# Altium schematic sheet USB3.0.SchDoc
size D; DocumentNumber: 3; SheetNumber: 3
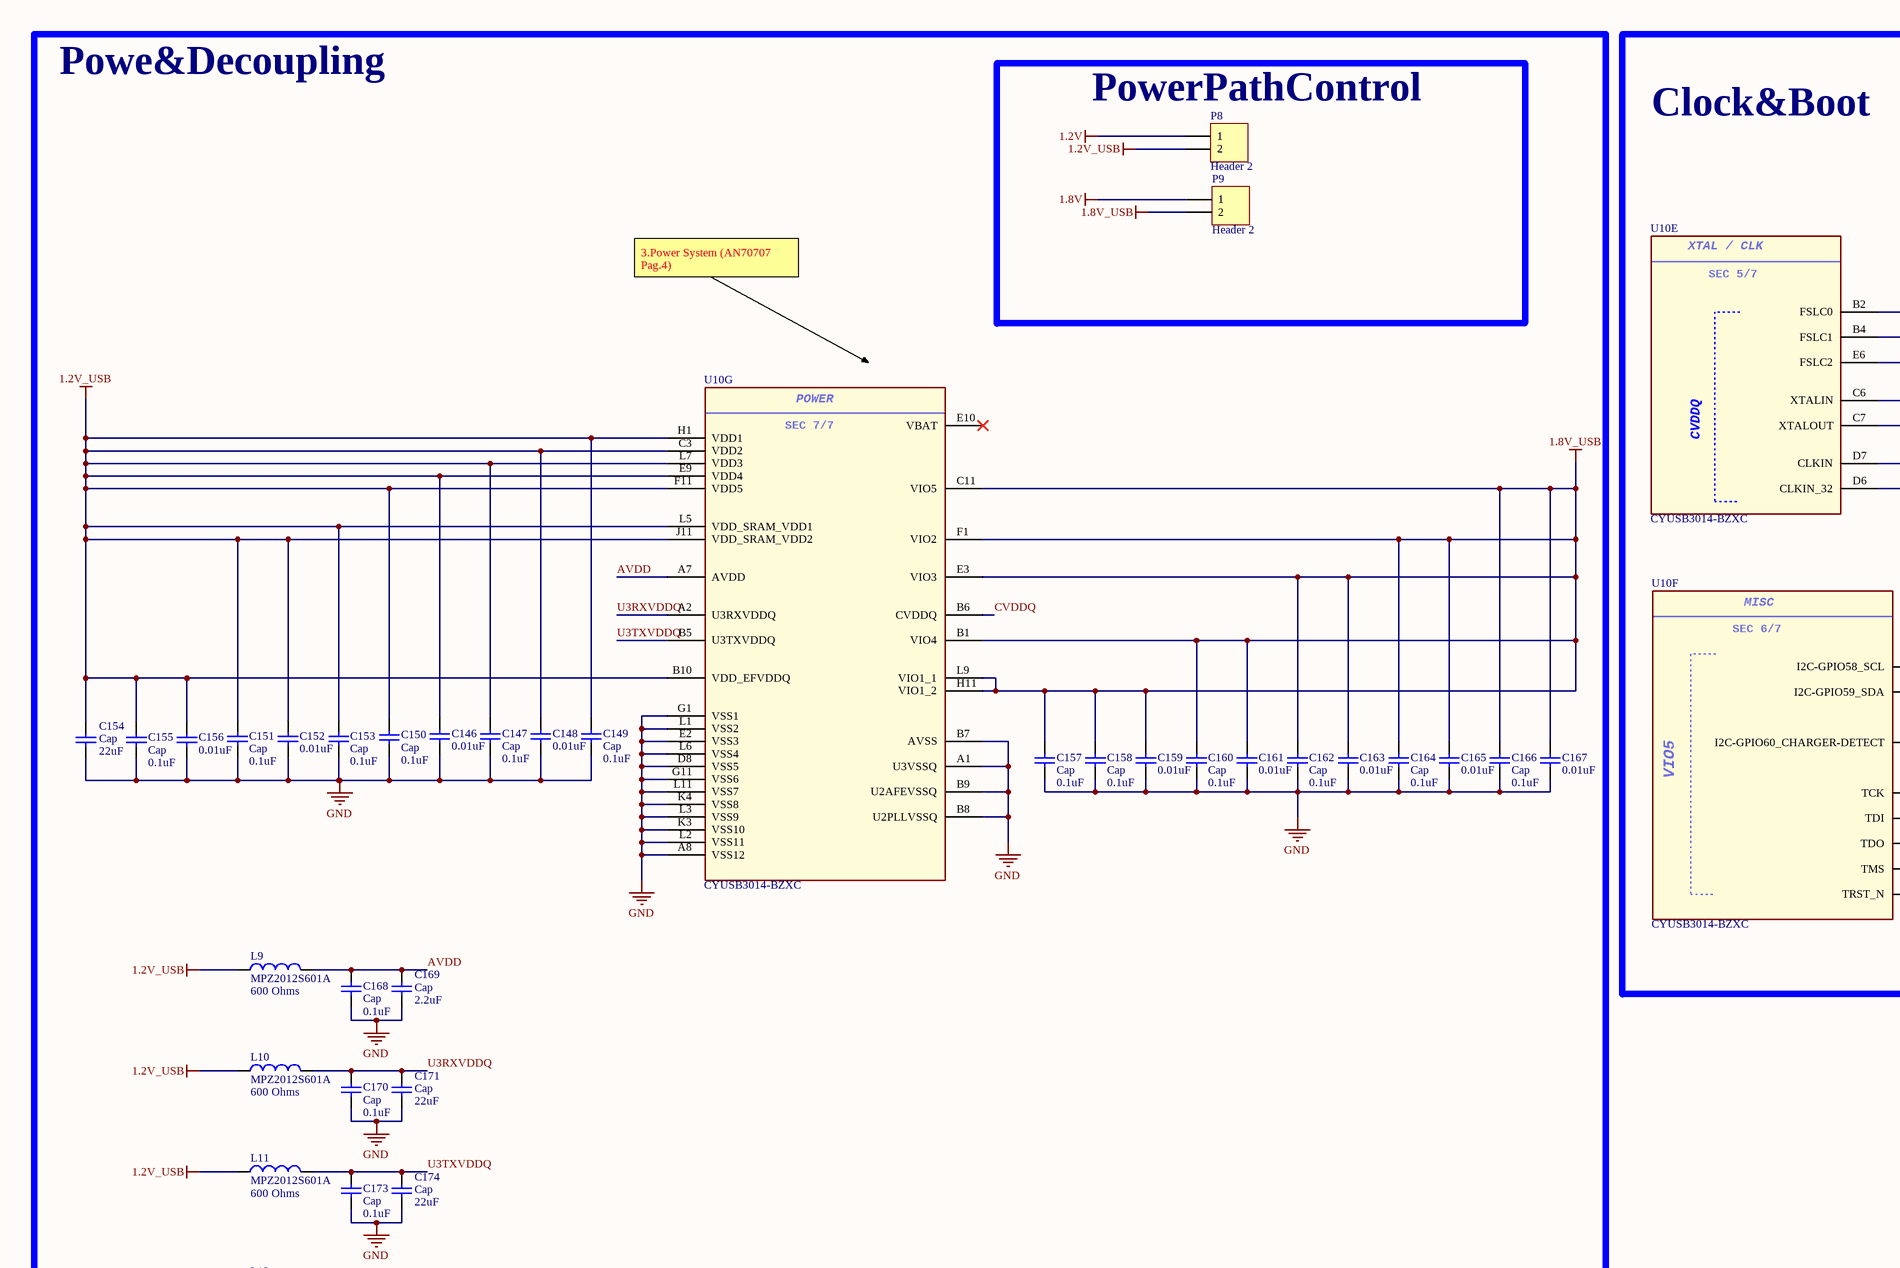
[diagram p0: USB3.0.SchDoc, top left]
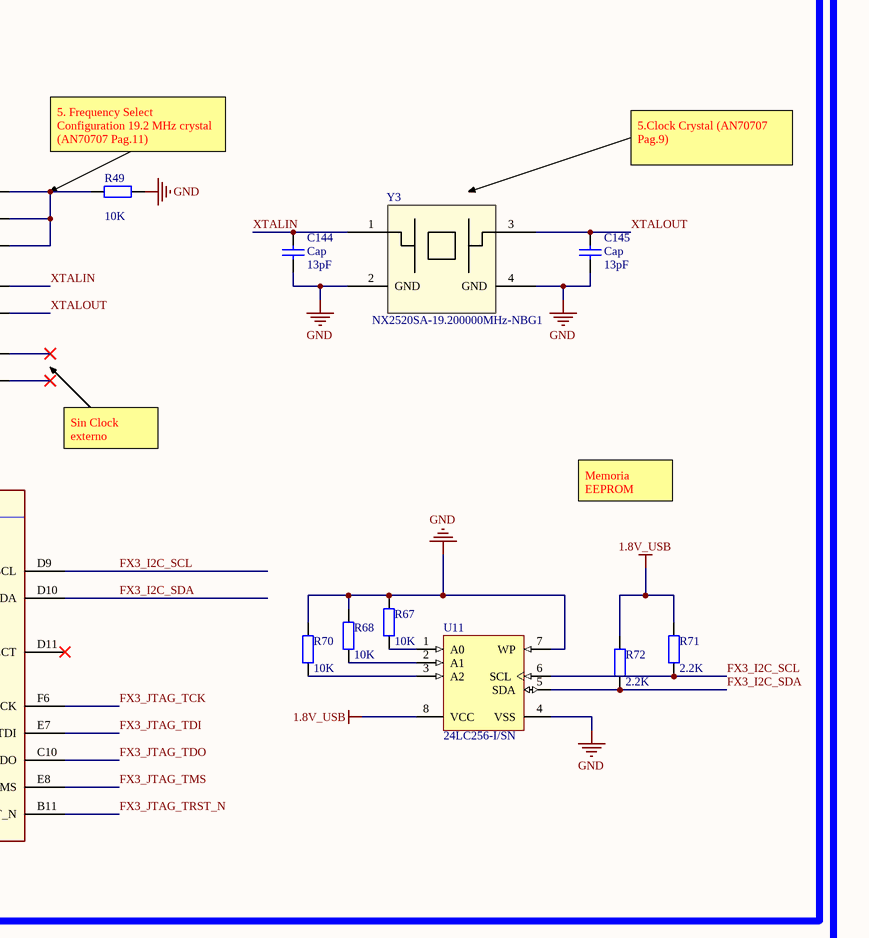
[diagram p1: USB3.0.SchDoc, top middle]
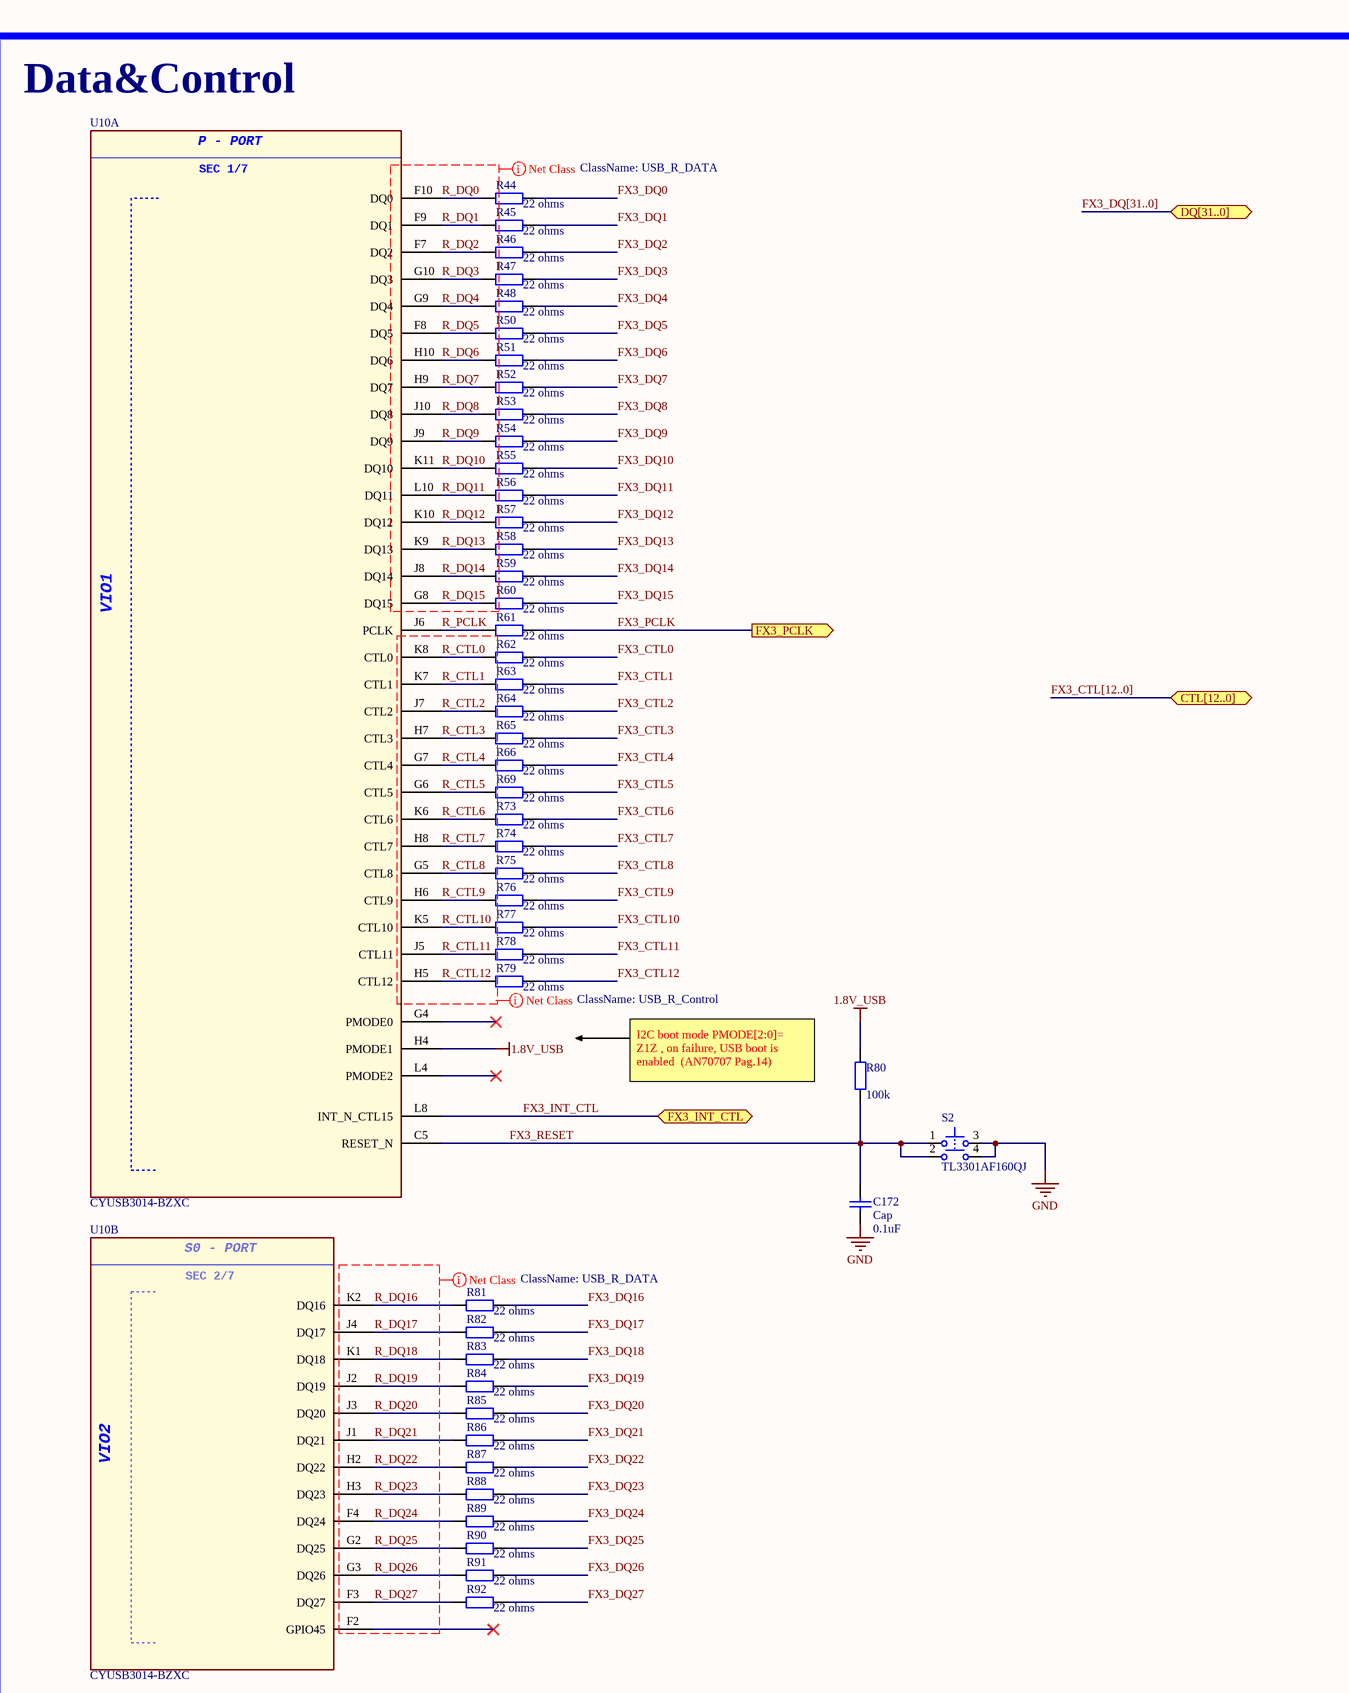
[diagram p2: USB3.0.SchDoc, top right]
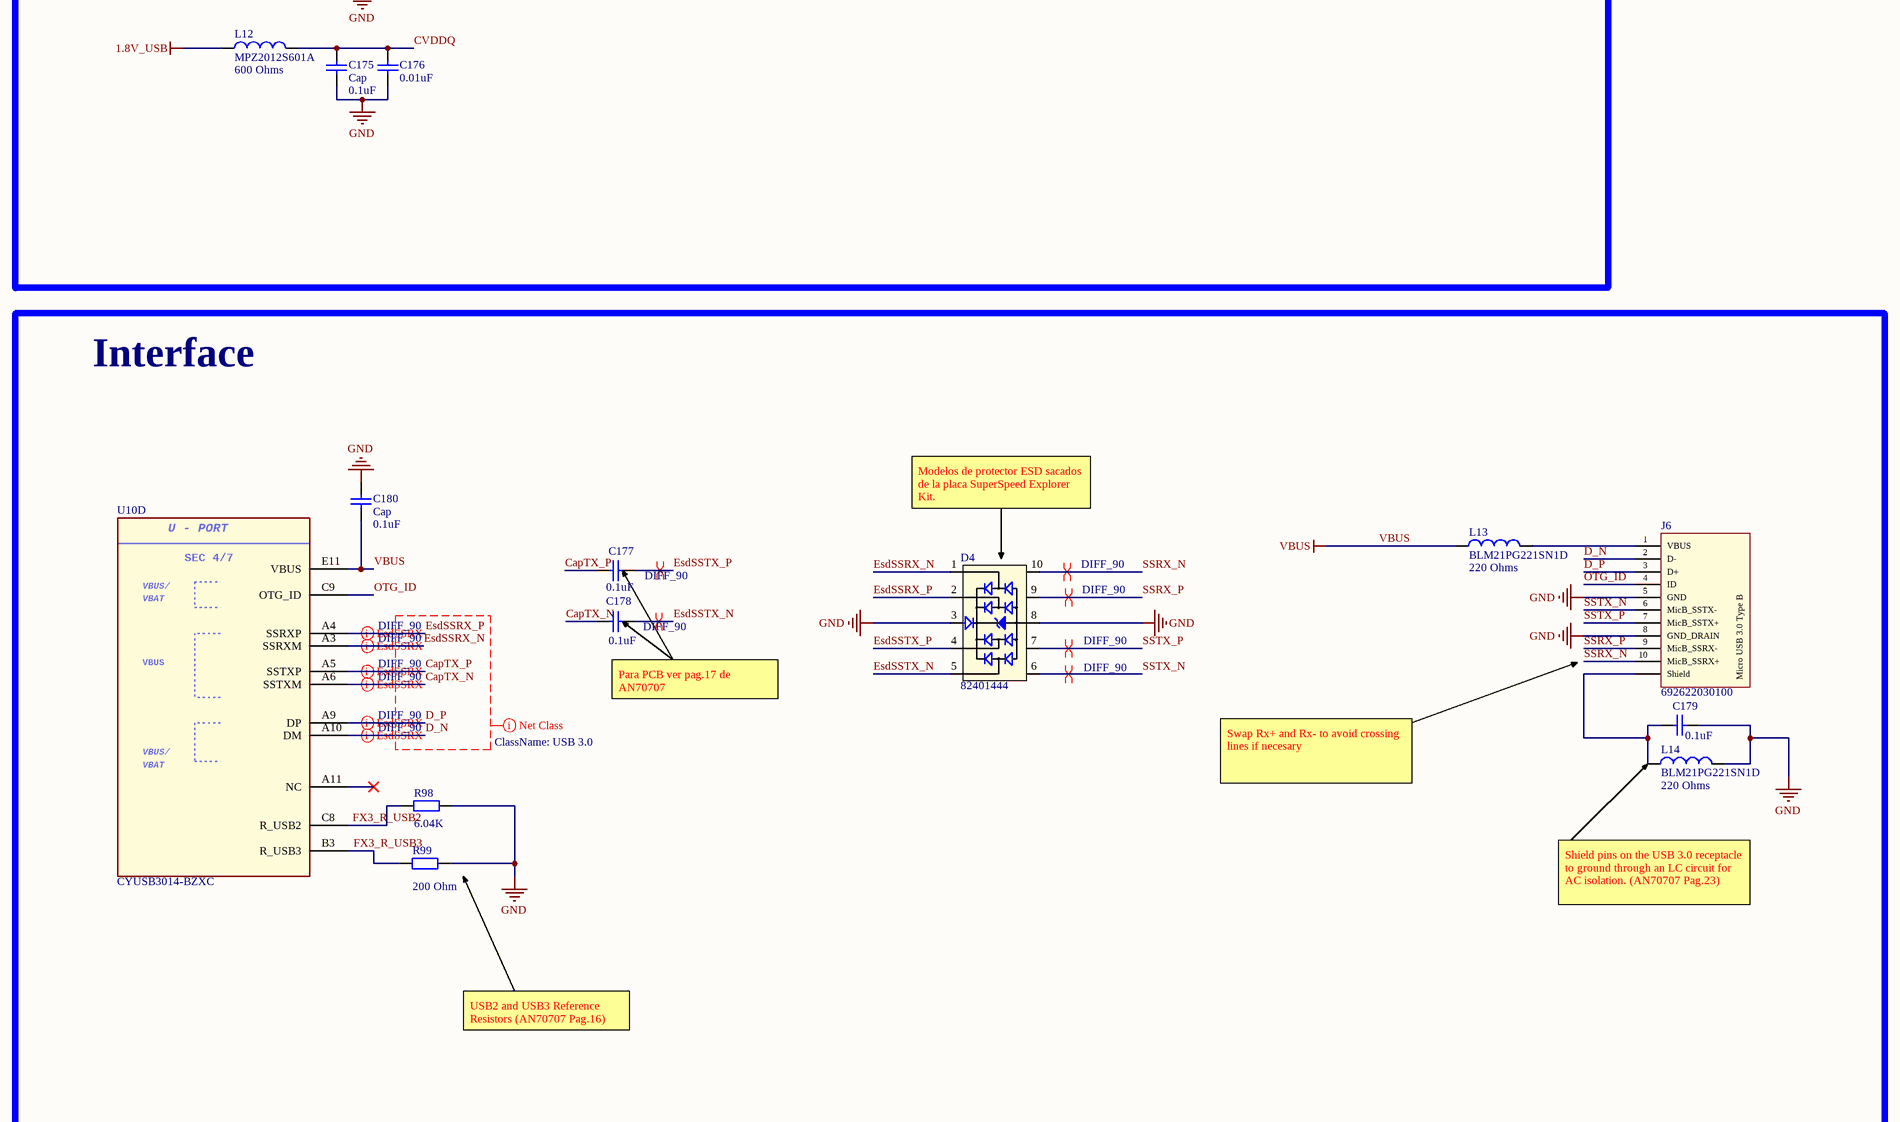
[diagram p3: USB3.0.SchDoc, bottom left]
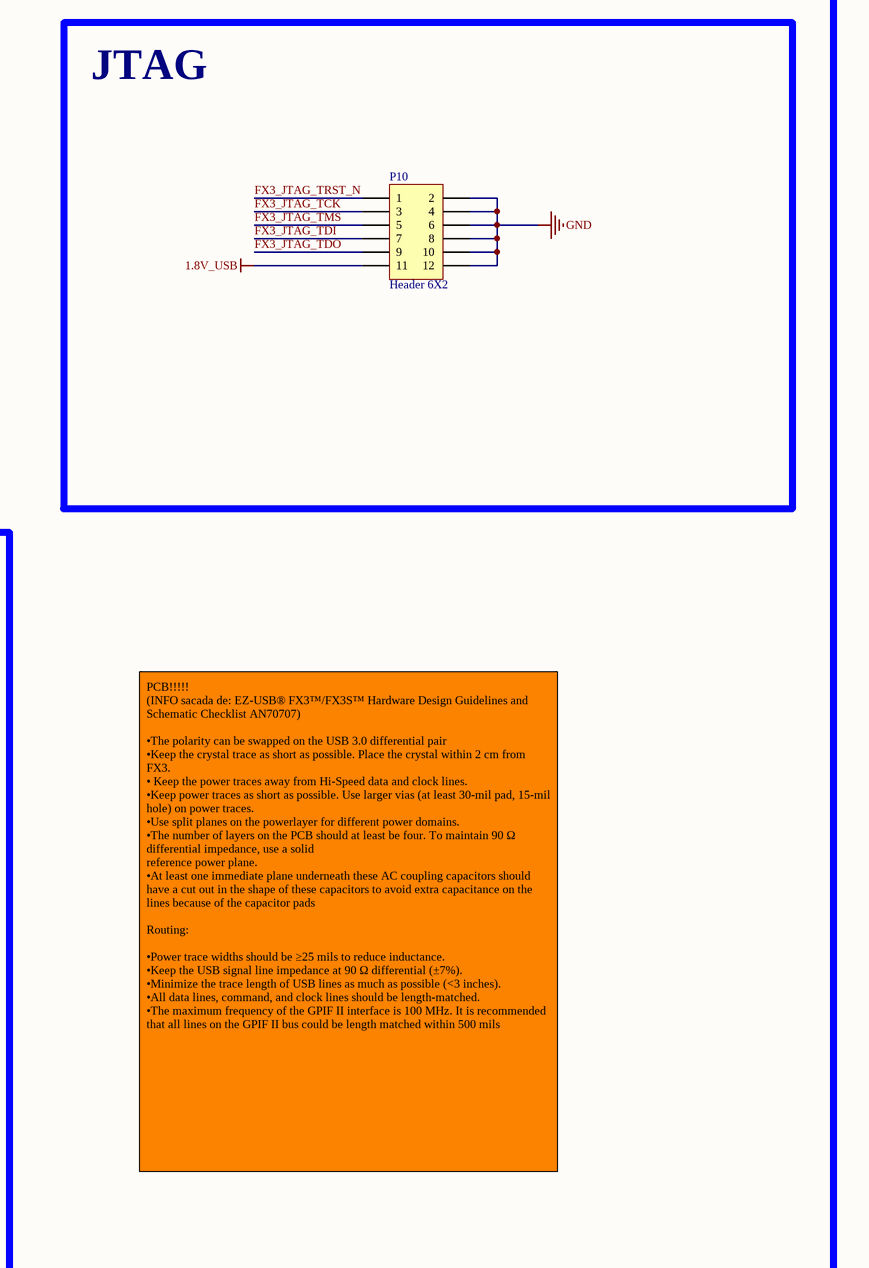
[diagram p4: USB3.0.SchDoc, bottom middle]
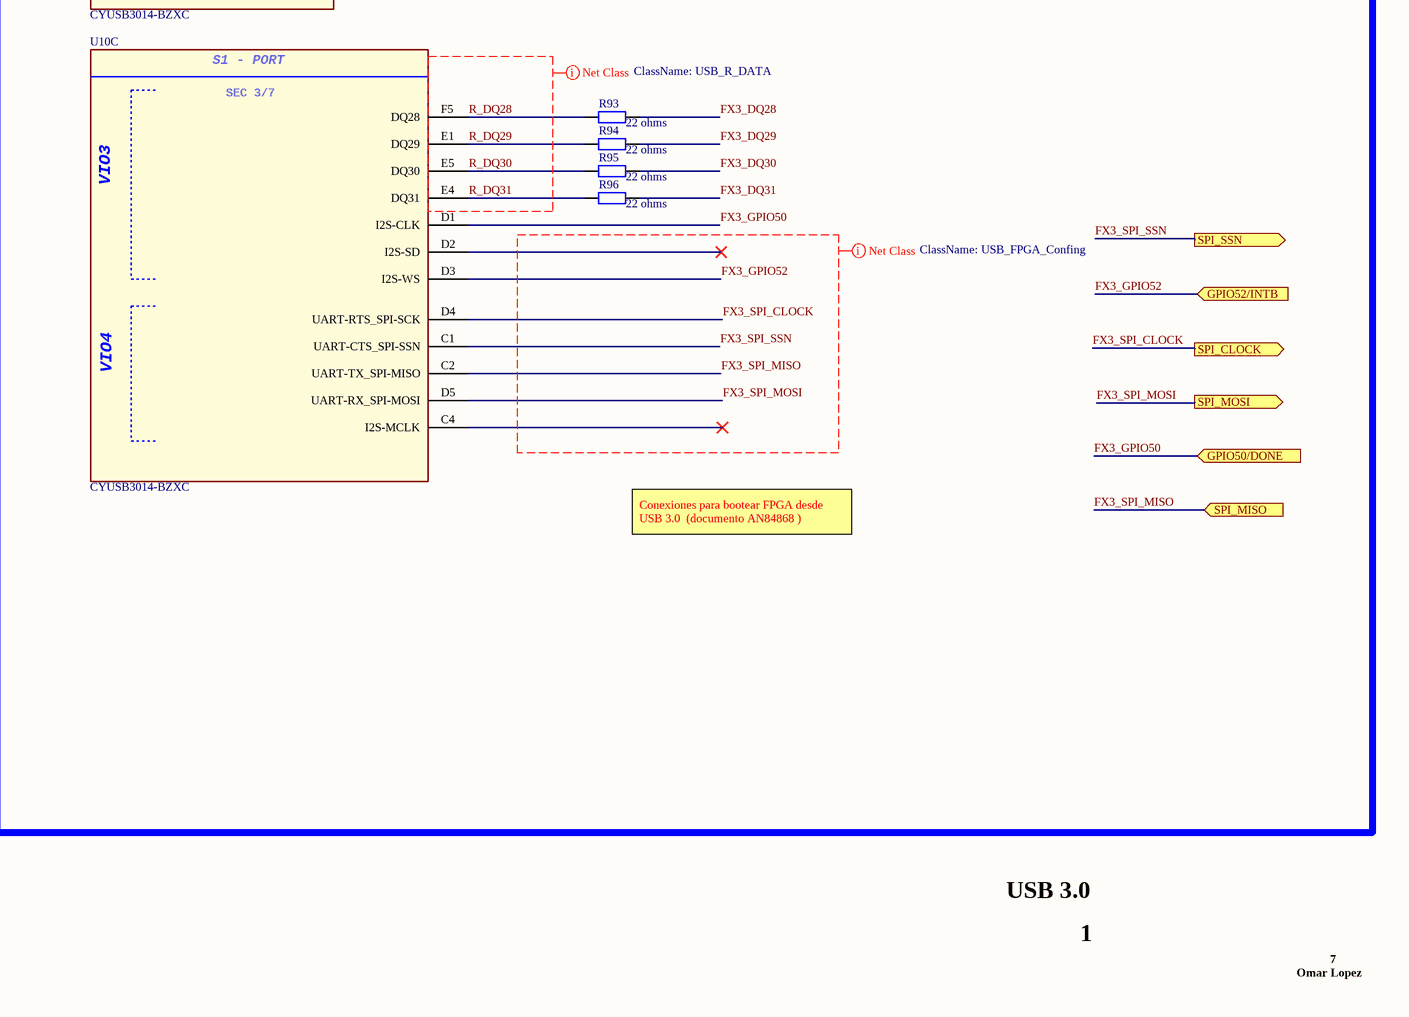
[diagram p5: USB3.0.SchDoc, bottom right]

## Parts
C144  Cap  value 13pF  [GRM0402MurataCap]
C145  Cap  value 13pF  [GRM0402MurataCap]
C146  value 0.01uF  [GRM0402MurataCap]  (hidden comment: Cap)
C147  Cap  value 0.1uF  [GRM0402MurataCap]
C148  value 0.01uF  [GRM0402MurataCap]  (hidden comment: Cap)
C149  Cap  value 0.1uF  [GRM0402MurataCap]
C150  Cap  value 0.1uF  [GRM0402MurataCap]
C151  Cap  value 0.1uF  [GRM0402MurataCap]
C152  value 0.01uF  [GRM0402MurataCap]  (hidden comment: Cap)
C153  Cap  value 0.1uF  [GRM0402MurataCap]
C154  Cap  value 22uF  [GRM0805MurataCap]
C155  Cap  value 0.1uF  [GRM0402MurataCap]
C156  value 0.01uF  [GRM0402MurataCap]  (hidden comment: Cap)
C157  Cap  value 0.1uF  [GRM0402MurataCap]
C158  Cap  value 0.1uF  [GRM0402MurataCap]
C159  value 0.01uF  [GRM0402MurataCap]  (hidden comment: Cap)
C160  Cap  value 0.1uF  [GRM0402MurataCap]
C161  value 0.01uF  [GRM0402MurataCap]  (hidden comment: Cap)
C162  Cap  value 0.1uF  [GRM0402MurataCap]
C163  value 0.01uF  [GRM0402MurataCap]  (hidden comment: Cap)
C164  Cap  value 0.1uF  [GRM0402MurataCap]
C165  value 0.01uF  [GRM0402MurataCap]  (hidden comment: Cap)
C166  Cap  value 0.1uF  [GRM0402MurataCap]
C167  value 0.01uF  [GRM0402MurataCap]  (hidden comment: Cap)
C168  Cap  value 0.1uF  [GRM0402MurataCap]
C169  Cap  value 2.2uF  [GRM0402MurataCap]
C170  Cap  value 0.1uF  [GRM0402MurataCap]
C171  Cap  value 22uF  [GRM0805MurataCap]
C172  Cap  value 0.1uF  [GRM0402MurataCap]
C173  Cap  value 0.1uF  [GRM0402MurataCap]
C174  Cap  value 22uF  [GRM0805MurataCap]
C175  Cap  value 0.1uF  [GRM0402MurataCap]
C176  value 0.01uF  [GRM0402MurataCap]  (hidden comment: Cap)
C177  value 0.1uF  [GRM0402MurataCap]
C178  value 0.1uF  [GRM0402MurataCap]
C179  value 0.1uF  [GRM0402MurataCap]
C180  Cap  value 0.1uF  [GRM0402MurataCap]
D4  82401444  [MSOP-10L]
J6  692622030100  [692622030100]
L9  MPZ2012S601A  value 600 Ohms  [MPZ2012]
L10  MPZ2012S601A  value 600 Ohms  [MPZ2012]
L11  MPZ2012S601A  value 600 Ohms  [MPZ2012]
L12  MPZ2012S601A  value 600 Ohms  [MPZ2012]
L13  BLM21PG221SN1D  value 220 Ohms  [BLM21]
L14  BLM21PG221SN1D  value 220 Ohms  [BLM21]
P8  Header 2  [Header2x1]
P9  Header 2  [Header2x1]
P10  Header 6X2  [HDR2X6]
R44  value 22 ohms  [RC0402N]
R45  value 22 ohms  [RC0402N]
R46  value 22 ohms  [RC0402N]
R47  value 22 ohms  [RC0402N]
R48  value 22 ohms  [RC0402N]
R49  value 10K  [RC0402N]
R50  value 22 ohms  [RC0402N]
R51  value 22 ohms  [RC0402N]
R52  value 22 ohms  [RC0402N]
R53  value 22 ohms  [RC0402N]
R54  value 22 ohms  [RC0402N]
R55  value 22 ohms  [RC0402N]
R56  value 22 ohms  [RC0402N]
R57  value 22 ohms  [RC0402N]
R58  value 22 ohms  [RC0402N]
R59  value 22 ohms  [RC0402N]
R60  value 22 ohms  [RC0402N]
R61  value 22 ohms  [RC0402N]
R62  value 22 ohms  [RC0402N]
R63  value 22 ohms  [RC0402N]
R64  value 22 ohms  [RC0402N]
R65  value 22 ohms  [RC0402N]
R66  value 22 ohms  [RC0402N]
R67  value 10K  [RC0402N]
R68  value 10K  [RC0402N]
R69  value 22 ohms  [RC0402N]
R70  value 10K  [RC0402N]
R71  value 2.2K  [RC0402N]
R72  value 2.2K  [RC0402N]
R73  value 22 ohms  [RC0402N]
R74  value 22 ohms  [RC0402N]
R75  value 22 ohms  [RC0402N]
R76  value 22 ohms  [RC0402N]
R77  value 22 ohms  [RC0402N]
R78  value 22 ohms  [RC0402N]
R79  value 22 ohms  [RC0402N]
R80  value 100k  [RC0402N]
R81  value 22 ohms  [RC0402N]
R82  value 22 ohms  [RC0402N]
R83  value 22 ohms  [RC0402N]
R84  value 22 ohms  [RC0402N]
R85  value 22 ohms  [RC0402N]
R86  value 22 ohms  [RC0402N]
R87  value 22 ohms  [RC0402N]
R88  value 22 ohms  [RC0402N]
R89  value 22 ohms  [RC0402N]
R90  value 22 ohms  [RC0402N]
R91  value 22 ohms  [RC0402N]
R92  value 22 ohms  [RC0402N]
R93  value 22 ohms  [RC0402N]
R94  value 22 ohms  [RC0402N]
R95  value 22 ohms  [RC0402N]
R96  value 22 ohms  [RC0402N]
R98  value 6.04K  [RC0402N]
R99  value 200 Ohm  [RC0402N]
S2  TL3301AF160QJ  [TL3301AF160QJ]
U10  CYUSB3014-BZXC  [BGA-121]  (parts A,B,C,D,E,F,G of 7)
U11  24LC256-I/SN  [SOIC8-N_MC]
Y3  NX2520SA-19.200000MHz-NBG1  [NX2520SA-19.200000MHz]

## Blocks framed on the sheet
Powe&Decoupling: C146-C171 C173-C176 L9-L12 U10
Clock&Boot: C144 C145 R49 R67 R68 R70-R72 U10 U11 Y3
Data&Control: C172 R44-R48 R50-R66 R69 R73-R96 S2 U10
PowerPathControl: P8 P9
JTAG: P10
Interface: C177-C180 D4 J6 L13 L14 R98 R99 U10

## Ports
CTL[12..0] (bidir), DQ[31..0] (bidir), FX3_INT_CTL (bidir), FX3_PCLK (out), GPIO50/DONE (in), GPIO52/INTB (in), SPI_CLOCK (out), SPI_MISO (in), SPI_MOSI (out), SPI_SSN (out)

## Nets
1.2V: P8.1
1.2V_USB: C146.2 C147.2 C148.2 C149.2 C150.2 C151.2 C152.2 C153.2 C154.1 C155.2 C156.2 L9.1 L10.1 L11.1 P8.2 U10.B10(VDD_EFVDDQ) U10.C3(VDD2) U10.E9(VDD4) U10.F11(VDD5) U10.H1(VDD1) U10.J11(VDD_SRAM_VDD2) U10.L5(VDD_SRAM_VDD1) U10.L7(VDD3)
1.8V: P9.1
1.8V_USB: C157.2 C158.2 C159.2 C160.2 C161.2 C162.2 C163.2 C164.2 C165.2 C166.2 C167.2 L12.1 P9.2 P10.11 R71.2 R72.2 R80.1 U10.B1(VIO4) U10.C11(VIO5) U10.E3(VIO3) U10.F1(VIO2) U10.H4(PMODE1) U10.H11(VIO1_2) U10.L9(VIO1_1) U11.8(VCC)
GND: C144.2 C145.2 C146.1 C147.1 C148.1 C149.1 C150.1 C151.1 C152.1 C153.1 C154.2 C155.1 C156.1 C157.1 C158.1 C159.1 C160.1 C161.1 C162.1 C163.1 C164.1 C165.1 C166.1 C167.1 C168.1 C169.2 C170.1 C171.2 C172.1 C173.1 C174.2 C175.1 C176.1 C179.1 C180.2 D4.3(VDD) D4.8(GND) J6.5(GND) J6.8(GND_DRAIN) L14.2 P10.2 P10.4 P10.6 P10.8 P10.10 P10.12 R49.2 R67.1 R68.1 R70.1 R98.1 R99.1 S2.3 S2.4 U10.A1(U3VSSQ) U10.A8(VSS12) U10.B7(AVSS) U10.B8(U2PLLVSSQ) U10.B9(U2AFEVSSQ) U10.D8(VSS5) U10.E2(VSS3) U10.G1(VSS1) U10.G11(VSS6) U10.K3(VSS10) U10.K4(VSS8) U10.L1(VSS2) U10.L2(VSS11) U10.L3(VSS9) U10.L6(VSS4) U10.L11(VSS7) U11.4(VSS) U11.7(WP) Y3.2(GND) Y3.4(GND)
VBUS: C180.1 L13.1 U10.E11(VBUS)
AVDD: C168.2 C169.1 L9.2 U10.A7(AVDD)
CapTX_N: C178.2 U10.A6(SSTXM)
CapTX_P: C177.2 U10.A5(SSTXP)
CVDDQ: C175.2 C176.2 L12.2 U10.B6(CVDDQ)
D_N: J6.2(D-) U10.A10(DM)
D_P: J6.3(D+) U10.A9(DP)
EsdSSRX_N: D4.1(I/O1) U10.A3(SSRXM)
EsdSSRX_P: D4.2(I/O2) U10.A4(SSRXP)
EsdSSTX_N: C178.1 D4.5(I/O4)
EsdSSTX_P: C177.1 D4.4(I/O3)
FX3_CTL0: R62.1
FX3_CTL1: R63.1
FX3_CTL2: R64.1
FX3_CTL3: R65.1
FX3_CTL4: R66.1
FX3_CTL5: R69.1
FX3_CTL6: R73.1
FX3_CTL7: R74.1
FX3_CTL8: R75.1
FX3_CTL9: R76.1
FX3_CTL10: R77.1
FX3_CTL11: R78.1
FX3_CTL12: R79.1
FX3_DQ0: R44.1
FX3_DQ1: R45.1
FX3_DQ2: R46.1
FX3_DQ3: R47.1
FX3_DQ4: R48.1
FX3_DQ5: R50.1
FX3_DQ6: R51.1
FX3_DQ7: R52.1
FX3_DQ8: R53.1
FX3_DQ9: R54.1
FX3_DQ10: R55.1
FX3_DQ11: R56.1
FX3_DQ12: R57.1
FX3_DQ13: R58.1
FX3_DQ14: R59.1
FX3_DQ15: R60.1
FX3_DQ16: R81.1
FX3_DQ17: R82.1
FX3_DQ18: R83.1
FX3_DQ19: R84.1
FX3_DQ20: R85.1
FX3_DQ21: R86.1
FX3_DQ22: R87.1
FX3_DQ23: R88.1
FX3_DQ24: R89.1
FX3_DQ25: R90.1
FX3_DQ26: R91.1
FX3_DQ27: R92.1
FX3_DQ28: R93.1
FX3_DQ29: R94.1
FX3_DQ30: R95.1
FX3_DQ31: R96.1
FX3_GPIO50: U10.D1(I2S-CLK) ; port GPIO50/DONE
FX3_GPIO52: U10.D3(I2S-WS) ; port GPIO52/INTB
FX3_I2C_SCL: R71.1 U10.D9(I2C-GPIO58_SCL) U11.6(SCL)
FX3_I2C_SDA: R72.1 U10.D10(I2C-GPIO59_SDA) U11.5(SDA)
FX3_INT_CTL: U10.L8(INT_N_CTL15) ; port FX3_INT_CTL
FX3_JTAG_TCK: P10.3 U10.F6(TCK)
FX3_JTAG_TDI: P10.7 U10.E7(TDI)
FX3_JTAG_TDO: P10.9 U10.C10(TDO)
FX3_JTAG_TMS: P10.5 U10.E8(TMS)
FX3_JTAG_TRST_N: P10.1 U10.B11(TRST_N)
FX3_PCLK: R61.1 ; port FX3_PCLK
FX3_R_USB2: R98.2 U10.C8(R_USB2)
FX3_R_USB3: R99.2 U10.B3(R_USB3)
FX3_RESET: C172.2 R80.2 S2.1 S2.2 U10.C5(RESET_N)
FX3_SPI_CLOCK: U10.D4(UART-RTS_SPI-SCK) ; port SPI_CLOCK
FX3_SPI_MISO: U10.C2(UART-TX_SPI-MISO) ; port SPI_MISO
FX3_SPI_MOSI: U10.D5(UART-RX_SPI-MOSI) ; port SPI_MOSI
FX3_SPI_SSN: U10.C1(UART-CTS_SPI-SSN) ; port SPI_SSN
OTG_ID: J6.4(ID) U10.C9(OTG_ID)
R_CTL0: R62.2 U10.K8(CTL0)
R_CTL1: R63.2 U10.K7(CTL1)
R_CTL2: R64.2 U10.J7(CTL2)
R_CTL3: R65.2 U10.H7(CTL3)
R_CTL4: R66.2 U10.G7(CTL4)
R_CTL5: R69.2 U10.G6(CTL5)
R_CTL6: R73.2 U10.K6(CTL6)
R_CTL7: R74.2 U10.H8(CTL7)
R_CTL8: R75.2 U10.G5(CTL8)
R_CTL9: R76.2 U10.H6(CTL9)
R_CTL10: R77.2 U10.K5(CTL10)
R_CTL11: R78.2 U10.J5(CTL11)
R_CTL12: R79.2 U10.H5(CTL12)
R_DQ0: R44.2 U10.F10(DQ0)
R_DQ1: R45.2 U10.F9(DQ1)
R_DQ2: R46.2 U10.F7(DQ2)
R_DQ3: R47.2 U10.G10(DQ3)
R_DQ4: R48.2 U10.G9(DQ4)
R_DQ5: R50.2 U10.F8(DQ5)
R_DQ6: R51.2 U10.H10(DQ6)
R_DQ7: R52.2 U10.H9(DQ7)
R_DQ8: R53.2 U10.J10(DQ8)
R_DQ9: R54.2 U10.J9(DQ9)
R_DQ10: R55.2 U10.K11(DQ10)
R_DQ11: R56.2 U10.L10(DQ11)
R_DQ12: R57.2 U10.K10(DQ12)
R_DQ13: R58.2 U10.K9(DQ13)
R_DQ14: R59.2 U10.J8(DQ14)
R_DQ15: R60.2 U10.G8(DQ15)
R_DQ16: R81.2 U10.K2(DQ16)
R_DQ17: R82.2 U10.J4(DQ17)
R_DQ18: R83.2 U10.K1(DQ18)
R_DQ19: R84.2 U10.J2(DQ19)
R_DQ20: R85.2 U10.J3(DQ20)
R_DQ21: R86.2 U10.J1(DQ21)
R_DQ22: R87.2 U10.H2(DQ22)
R_DQ23: R88.2 U10.H3(DQ23)
R_DQ24: R89.2 U10.F4(DQ24)
R_DQ25: R90.2 U10.G2(DQ25)
R_DQ26: R91.2 U10.G3(DQ26)
R_DQ27: R92.2 U10.F3(DQ27)
R_DQ28: R93.2 U10.F5(DQ28)
R_DQ29: R94.2 U10.E1(DQ29)
R_DQ30: R95.2 U10.E5(DQ30)
R_DQ31: R96.2 U10.E4(DQ31)
R_PCLK: R61.2 U10.J6(PCLK)
SSRX_N: D4.10(NC) J6.10(MicB_SSRX+)
SSRX_P: D4.9(NC) J6.9(MicB_SSRX-)
SSTX_N: D4.6(NC) J6.6(MicB_SSTX-)
SSTX_P: D4.7(NC) J6.7(MicB_SSTX+)
U3RXVDDQ: C170.2 C171.1 L10.2 U10.A2(U3RXVDDQ)
U3TXVDDQ: C173.2 C174.1 L11.2 U10.B5(U3TXVDDQ)
XTALIN: C144.1 U10.C6(XTALIN) Y3.1
XTALOUT: C145.1 U10.C7(XTALOUT) Y3.3
NetC179_2: C179.2 J6.Shell(Shield) L14.1
NetJ6_1: J6.1(VBUS) L13.2
NetR49_1: R49.1 U10.B2(FSLC0) U10.B4(FSLC1) U10.E6(FSLC2)
NetR67_2: R67.2 U11.1(A0)
NetR68_2: R68.2 U11.2(A1)
NetR70_2: R70.2 U11.3(A2)

Not connected (* = marked no-connect by the designer): U10 A11(NC)* C4(I2S-MCLK)* D2(I2S-SD)* D6(CLKIN_32)* D7(CLKIN)* D11(I2C-GPIO60_CHARGER-DETECT)* E10(VBAT)* F2(GPIO45)* G4(PMODE0)* L4(PMODE2)*

## Buses and harness runs
bus FX3_CTL[12..0] = port CTL[12..0]
bus FX3_DQ[31..0] = port DQ[31..0]

## Layout directives
differential pair; net class DIFF_90: CapTX_N, CapTX_P, D_N, D_P, EsdSSRX_N, EsdSSRX_P, EsdSSTX_N, EsdSSTX_P, SSRX_N, SSRX_P, SSTX_N, SSTX_P
net class USB 3.0: CapTX_N, CapTX_P, D_N, D_P, EsdSSRX_N, EsdSSRX_P
net class USB_R_Control: R_CTL0, R_CTL1, R_CTL2, R_CTL3, R_CTL4, R_CTL5, R_CTL6, R_CTL7, R_CTL8, R_CTL9, R_CTL10, R_CTL11, R_CTL12
net class USB_R_DATA: R_DQ0, R_DQ1, R_DQ2, R_DQ3, R_DQ4, R_DQ5, R_DQ6, R_DQ7, R_DQ8, R_DQ9, R_DQ10, R_DQ11, R_DQ12, R_DQ13, R_DQ14, R_DQ15, R_DQ16, R_DQ17, R_DQ18, R_DQ19, R_DQ20, R_DQ21, R_DQ22, R_DQ23, R_DQ24, R_DQ25, R_DQ26, R_DQ27, R_DQ28, R_DQ29, R_DQ30, R_DQ31
net class USB_FPGA_Confing: FX3_GPIO52, FX3_SPI_CLOCK, FX3_SPI_MISO, FX3_SPI_MOSI, FX3_SPI_SSN

## Notes on the sheet
- 3.Power System (AN70707 Pag.4)
- (near R49) 5. Frequency Select Configuration 19.2 MHz crystal  (AN70707 Pag.11)
- 5.Clock Crystal (AN70707 Pag.9)
- Sin Clock externo
- Memoria EEPROM
- (near R80) I2C boot mode PMODE[2:0]= Z1Z , on failure, USB boot is enabled  (AN70707 Pag.14)
- Modelos de protector ESD sacados de la placa SuperSpeed Explorer Kit.
- (near C178) Para PCB ver pag.17 de AN70707
- Swap Rx+ and Rx- to avoid crossing lines if necesary
- Conexiones para bootear FPGA desde USB 3.0  (documento AN84868 )
- Shield pins on the USB 3.0 receptacle to ground through an LC circuit for AC isolation. (AN70707 Pag.23)
- PCB!!!!!
  (INFO sacada de: EZ-USB® FX3™/FX3S™ Hardware Design Guidelines and Schematic Checklist AN70707)
  •The polarity can be swapped on the USB 3.0 differential pair
  •Keep the crystal trace as short as possible. Place the crystal within 2 cm from FX3.
  • Keep the power traces away from Hi-Speed data and clock lines.
  •Keep power traces as short as possible. Use larger vias (at least 30-mil pad, 15-mil hole) on power traces.
  •Use split planes on the powerlayer for different power domains.
  •The number of layers on the PCB should at least be four. To maintain 90 Ω differential impedance, use a solid
  reference power plane.
  •At least one immediate plane underneath these AC coupling capacitors should have a cut out in the shape of these capacitors to avoid extra capacitance on the lines because of the capacitor pads
  Routing:
  •Power trace widths should be ≥25 mils to reduce inductance.
  •Keep the USB signal line impedance at 90 Ω differential (±7%).
  •Minimize the trace length of USB lines as much as possible (<3 inches).
  •All data lines, command, and clock lines should be length-matched.
  •The maximum frequency of the GPIF II interface is 100 MHz. It is recommended that all lines on the GPIF II bus could be length matched within 500 mils
- USB2 and USB3 Reference Resistors (AN70707 Pag.16)
- USB 3.0
- 1
- Omar Lopez
- 7
- (in symbol 692622030100) Micro USB 3.0 Type B
- (in symbol FX3_121_BUMP_4, part A) P - PORT; SEC 1/7; VIO1
- (in symbol FX3_121_BUMP_4, part B) S0 - PORT; SEC 2/7
- (in symbol FX3_121_BUMP_4, part C) S1 - PORT; SEC 3/7
- (in symbol FX3_121_BUMP_4, part D) U - PORT; SEC 4/7; VBUS/
- (in symbol FX3_121_BUMP_4, part E) XTAL / CLK; SEC 5/7
- (in symbol FX3_121_BUMP_4, part F) MISC; SEC 6/7
- (in symbol FX3_121_BUMP_4, part G) POWER; SEC 7/7

## Library data of the parts
C144 C145 = Cap: Capacitor; Manufacturer: Murata; PartNumber: GRM1555C1H130GA01D; Tolerance: 2%; Descripción: SMD/SMT 0402 13pF 50volts C0G 2%; CostoVendedor1: 0.12; CostoVendedor2: 0.13; Vendedor1: Mouser; Vendedor2: Digi-Key; Package: 0402; DataSheet: http://www.mouser.com/ds/2/281/c02e-2905.pdf; LinkVendedor1: https://ar.mouser.com/ProductDetail/Murata-Electronics/GRM1555C1H130GA01D?qs=%2fha2pyFaduiGTOITjt%2fF7yG0aFmPUZSOtxgwyDJzTmOb1qvb0h0MQBblGInCC%252bk9; LinkVendedor2: https://www.digikey.com/product-detail/en/murata-electronics-north-america/GRM1555C1H130GA01D/490-8184-1-ND/4380477; Stock1: 1700; Stock2: 14000
C146 C148 C152 C156 C159 C161 C163 C165 C167 C176 = Cap: Capacitor; Manufacturer: Murata; PartNumber: GCG155L81E103KA01D; Tolerance: 10%; Descripción: SMD/SMT 0402 0.01uF 25volts X7R 10%; CostoVendedor1: 0.19; Vendedor1: Mouser; Vendedor2: Digi-Key; Package: 0402; DataSheet: https://ar.mouser.com/datasheet/2/281/c03e-516224.pdf; LinkVendedor1: https://ar.mouser.com/ProductDetail/Murata-Electronics/GCG155L81E103KA01D?qs=sGAEpiMZZMs0AnBnWHyRQID2xuQsFd1G0H3MNkFLCyvrnbiUuoaHUg%3d%3d; Stock1: 8800
C147 C149-C151 C153 C155 C157 C158 C160 C162 C164 C166 C168 C170 C172 C173 C175 C177-C180 = Cap: Capacitor; Manufacturer: Murata; PartNumber: GRM155R71C104JA88J; Tolerance: 10%; Descripción: 16V  smd; CostoVendedor1: 0.038; Vendedor1: Mouser; Vendedor2: Digi-Key; Package: 0402; DataSheet: http://www.mouser.com/ds/2/281/c02e-2905.pdf; LinkVendedor1: https://ar.mouser.com/ProductDetail/Murata-Electronics/GRM155R71C104JA88J?qs=sGAEpiMZZMs0AnBnWHyRQFv7x1xn%252bYFdm0Vh6fxhMY51u8SdTXijCg%3d%3d; Stock1: 4800
C154 C171 C174 = Cap: Capacitor; Manufacturer: Murata; PartNumber: GRM219R61C226ME15L; Tolerance: 10%; Descripción: 25V  smd; CostoVendedor1: 0.45; CostoVendedor2: 0.51; Vendedor1: Mouser; Vendedor2: Digi-Key; Package: 0805; DataSheet: http://www.mouser.com/ds/2/281/product-794362.pdf; LinkVendedor1: https://ar.mouser.com/ProductDetail/Murata-Electronics/GRM219R61C226ME15L?qs=sGAEpiMZZMs0AnBnWHyRQFv7x1xn%252bYFdlpx3rHjqsYGFGOccM8ifgQ%3d%3d; LinkVendedor2: https://www.digikey.com/product-detail/en/murata-electronics-north-america/GRM219R61C226ME15L/490-9952-1-ND/5026415; Stock1: 23000; Stock2: 400000
C169 = Cap: Capacitor; Manufacturer: Murata; PartNumber: GRT155R61E225KE13D; Tolerance: 10%; Descripción: 16V  smd; CostoVendedor1: 0.31; Vendedor1: Mouser; Vendedor2: Digi-Key; Package: 0402; DataSheet: http://www.mouser.com/ds/2/281/product-794258.pdf; LinkVendedor1: https://ar.mouser.com/ProductDetail/Murata-Electronics/GRT155R61E225KE13D?qs=%2fha2pyFadugDz9MH5HufkUFjB67%2fqIb%252b2zKgUM%252bWVYEFYanDgYaJM0uBHf%2fw3BwI; Stock1: 13000
D4 = WE-TVS-SS,MSOP-10L, 82401444: TVS Diode WE-TVS-SS, VRWM=5V; Manufacturer: Würth Elektronik eiSos GmbH; Descripción: Supresores de descargas electrostáticas; CostoVendedor1: 1.48; Vendedor1: Mouser; Vendedor2: Digi-Key; DataSheet: http://www.mouser.com/ds/2/445/82401444-372914.pdf; PartNumber: 82401444; LinkVendedor1: https://ar.mouser.com/ProductDetail/Wurth-Electronics/82401444?qs=%2fha2pyFadugrqVOnhQc9hRTe12XdQqMCDj%2fJCcJVK2M%3d; Stock1: 2900
J6 = 692622030100: Micro USB 3.0 Type B Horizontal SMT WR-COM; Vendedor1: Mouser; Vendedor2: Digi-Key
L9-L12 = Inductor: Manufacturer: TDK; Descripción: Núcleos de ferrita Ferrite Chip Beads; CostoVendedor1: 0.12; CostoVendedor2: 0.11; Vendedor1: Mouser; Vendedor2: Digi-Key; DataSheet: http://www.mouser.com/ds/2/400/eads_commercial_power_mpz2012_en-923646.pdf; Package: 0805; PartNumber: MPZ2012S601A; LinkVendedor1: https://ar.mouser.com/ProductDetail/TDK/MPZ2012S601A?qs=sGAEpiMZZMtdyQheitOmRaspPRlp9Yc%252bsdFgCvfaA6I%3d; LinkVendedor2: https://www.digikey.com/product-detail/en/tdk-corporation/MPZ2012S601AT000/445-2206-1-ND/765104; Stock1: 120000; Stock2: 20000
L13 L14 = Inductor: Manufacturer: Murata; Descripción: Núcleos de ferrita 0805 220 OHM; Tolerance: 25%; CostoVendedor1: 0.10; Vendedor1: Mouser; Vendedor2: Digi-Key; DataSheet: http://www.mouser.com/ds/2/281/c31e-794748.pdf; Package: 0805; PartNumber: BLM21PG221SN1D; LinkVendedor1: https://ar.mouser.com/ProductDetail/Murata-Electronics/BLM21PG221SN1D?qs=%2fha2pyFadujxD5ks3AjdffkJPlzxWbOj5FSW5VIu4iL4EWSt9l651Q%3d%3d; Stock1: 450000
P8 P9 = Header 2: Header, 2-Pin; Manufacturer: TE Connectivity; PartNumber: 826629; Descripción: Header 2x1 step 2,54mm; CostoVendedor1: 0.18; Vendedor1: Mouser; Vendedor2: Digi-Key; DataSheet: https://ar.mouser.com/datasheet/2/418/NG_CD_826629_AC-673634.pdf; LinkVendedor1: https://ar.mouser.com/ProductDetail/TE-Connectivity-AMP/5-826629-0?qs=sGAEpiMZZMuSK2mCDyT9clxPLHEBGojU; Stock1: 3600
P10 = Header 6X2: Header, 6-Pin, Dual row; Vendedor1: Mouser; Vendedor2: Digi-Key
R44-R48 R50-R66 R69 R73-R79 R81-R96 = Res2: Resistor; Manufacturer: Panasonic; PartNumber: ERJ-2RKF22R0X; Tolerance: 1%; Descripción: 100mW 50V; CostoVendedor1: 0.021; Vendedor1: Mouser; Vendedor2: Digi-Key; Package: 0402; DataSheet: http://www.mouser.com/ds/2/315/AOA0000C86-911473.pdf; LinkVendedor1: https://ar.mouser.com/ProductDetail/Panasonic-Industrial-Devices/ERJ-2RKF22R0X?qs=%2fha2pyFadujciewGcSbxYI%2fad%2fmth8TfMt3TuGSupPsgbmCsjuiYug%3d%3d; Stock1: 520000
R49 R67 R68 R70 = Res2: Resistor; Manufacturer: Panasonic; PartNumber: ERJ-2RKF1002X; Tolerance: 1%; Descripción: 100mW 50V; CostoVendedor1: 0.021; Vendedor1: Mouser; Vendedor2: Digi-Key; Package: 0402; DataSheet: http://www.mouser.com/ds/2/315/AOA0000C86-911473.pdf; LinkVendedor1: https://ar.mouser.com/ProductDetail/Panasonic-Industrial-Devices/ERJ-2RKF1002X?qs=%2fha2pyFadujciewGcSbxYCeocmJ1V0ffuiBNpRUU2nm5e2XaRJ685Q%3d%3d; Stock1: 2000000
R71 R72 = Res2: Resistor; Manufacturer: Panasonic; PartNumber: ERJ-2RKF2201X; Tolerance: 1%; Descripción: 100mW 50V; CostoVendedor1: 0.021; Vendedor1: Mouser; Vendedor2: Digi-Key; Package: 0402; DataSheet: http://www.mouser.com/ds/2/315/AOA0000C86-911473.pdf; LinkVendedor1: https://ar.mouser.com/ProductDetail/Panasonic-Industrial-Devices/ERJ-2RKF2201X?qs=%2fha2pyFadujciewGcSbxYBlJjTKWCkDhEeo%2fFoOyGLEXIXB9mWKCWw%3d%3d; Stock1: 130000
R80 = Res2: Resistor; Manufacturer: Panasonic; PartNumber: ERJ-2RKF1003X; Tolerance: 1%; Descripción: 100mW 50V; CostoVendedor1: 0.021; Vendedor1: Mouser; Vendedor2: Digi-Key; Package: 0402; DataSheet: http://www.mouser.com/ds/2/315/AOA0000C86-911473.pdf; LinkVendedor1: https://ar.mouser.com/ProductDetail/Panasonic-Industrial-Devices/ERJ-2RKF1003X?qs=%2fha2pyFadujciewGcSbxYJOA56ny1fqECTP0AcRmbHTZSqniIUcBDA%3d%3d; Stock1: 1000000
R98 = Res2: Resistor; Manufacturer: Panasonic; PartNumber: ERJ-P03F6041V; Tolerance: 1%; Descripción: Resistores de película gruesa - SMD 0603 6.04Kohm 1% Anti-Surge AEC-Q200; CostoVendedor1: 0.58; Vendedor1: Mouser; Vendedor2: Digi-Key; Package: 0603; DataSheet: http://www.mouser.com/ds/2/315/AOA0000C243-947438.pdf; LinkVendedor1: https://ar.mouser.com/ProductDetail/Panasonic/ERJ-P03F6041V?qs=sGAEpiMZZMu61qfTUdNhG6hHVqnyaoDdDJMdIuioqt4%3d; Stock1: 4600
R99 = Res2: Resistor; Manufacturer: Panasonic; PartNumber: ERJ-3EKF2000V; Tolerance: 1%; Descripción: Resistores de película gruesa - SMD 0603 200ohms 0.2W 1% AEC-Q200; CostoVendedor1: 0.58; Vendedor1: Mouser; Vendedor2: Digi-Key; Package: 0603; DataSheet: http://www.mouser.com/ds/2/315/AOA0000C243-947463.pdf; LinkVendedor1: https://ar.mouser.com/ProductDetail/Panasonic-Industrial-Devices/ERJ-3EKF2000V?qs=sGAEpiMZZMu61qfTUdNhGzRxdwze5h8Z%252bNUYPmXkyK8%3d; Stock1: 61000
S2 = IT-2175: Tactile Switch, DPST; Thru-Hole; Vertical; Rating DC 12V, 50mA (max); Manufacturer: E-Switch; Descripción: Interruptores táctiles SPST SMD J-LEAD; CostoVendedor1: 0.43; Vendedor1: Mouser; Vendedor2: Digi-Key; DataSheet: https://www.e-switch.com/system/asset/product_line/data_sheet/158/TL3301.pdf; Package: J; PartNumber: TL3301AF160QJ; CostoVendedor2: 0.43; LinkVendedor1: https://ar.mouser.com/ProductDetail/E-Switch/TL3301AF160QJ?qs=%2fha2pyFadujx3gv2iG25gcw5Jio7UDqaqTkcH4vR60LrUmuJb9BKTQ%3d%3d; LinkVendedor2: https://www.digikey.com/product-detail/en/e-switch/TL3301AF160QJ/EG4374CT-ND/1144804; Stock1: 2800; Stock2: 44000
U10 = FX3_121_BUMP_4: USB Controller; Manufacturer: Cypress Semiconductor; CostoVendedor1: 30.7; CostoVendedor2: 31.7; Vendedor1: Mouser; Vendedor2: Digi-Key; DataSheet: http://www.mouser.com/ds/2/100/001-52136_CYUSB301X_CYUSB201X_EZ-USB_R_FX3_SUPERSP-371593.pdf; Descripción: USB Controller; Package: BGA-121; PartNumber: CYUSB3014-BZXC; LinkVendedor1: https://ar.mouser.com/ProductDetail/Cypress-Semiconductor/CYUSB3014-BZXC?qs=sGAEpiMZZMtv%252bwxsgy%2fhiKzKeKykxm1HOnMAKcwg04A%3d; LinkVendedor2: https://www.digikey.com/product-detail/en/cypress-semiconductor-corp/CYUSB3014-BZXC/428-3182-ND/3679585; Stock1: 4000; Stock2: 3500
U11 = 24LC256-I/SN: 256Kbit, 400kHz, 2.5V, I2C Serial EEPROM, 8-Pin SOIC 150mil, Industrial Temperature; Manufacturer: Microchip; PartNumber: 24LC256T-I/SN; Descripción: EEPROM 32kx8 - 2.5V; CostoVendedor1: 0.92; Vendedor1: Mouser; Vendedor2: Digi-Key; DataSheet: http://ww1.microchip.com/downloads/en/DeviceDoc/20001203U.pdf; Package: SOIC8; LinkVendedor1: https://ar.mouser.com/ProductDetail/Microchip-Technology/24LC256T-I-SN?qs=sGAEpiMZZMuVhdAcoizlRfa9Ygym%252bTXjZOCyhyW7tm0%3d; Stock1: 5600
Y3 = Component_1: Cristales 19.2000MHz 10ppm 7pF -30C +85C; Manufacturer: NDK; PartNumber: EXS00A-CS05400; CostoVendedor2: 1.29; Vendedor1: Mouser; Vendedor2: Digi-Key; DataSheet: https://media.digikey.com/pdf/Data%20Sheets/NDK%20PDFs/NX2520SA-19.200000MHZ-NBG1.pdf; Descripción: Cristales 19.2000MHz 10ppm 7pF -30C +85C; Package: NX2520SA; LinkVendedor2: https://www.digikey.com/product-detail/en/ndk-america-inc/EXS00A-CS05400/644-1162-1-ND/3125551; Stock2: 8800